# EAGLE board Spuds-V0.6 (EAGLE 6.4), part 1 of 2
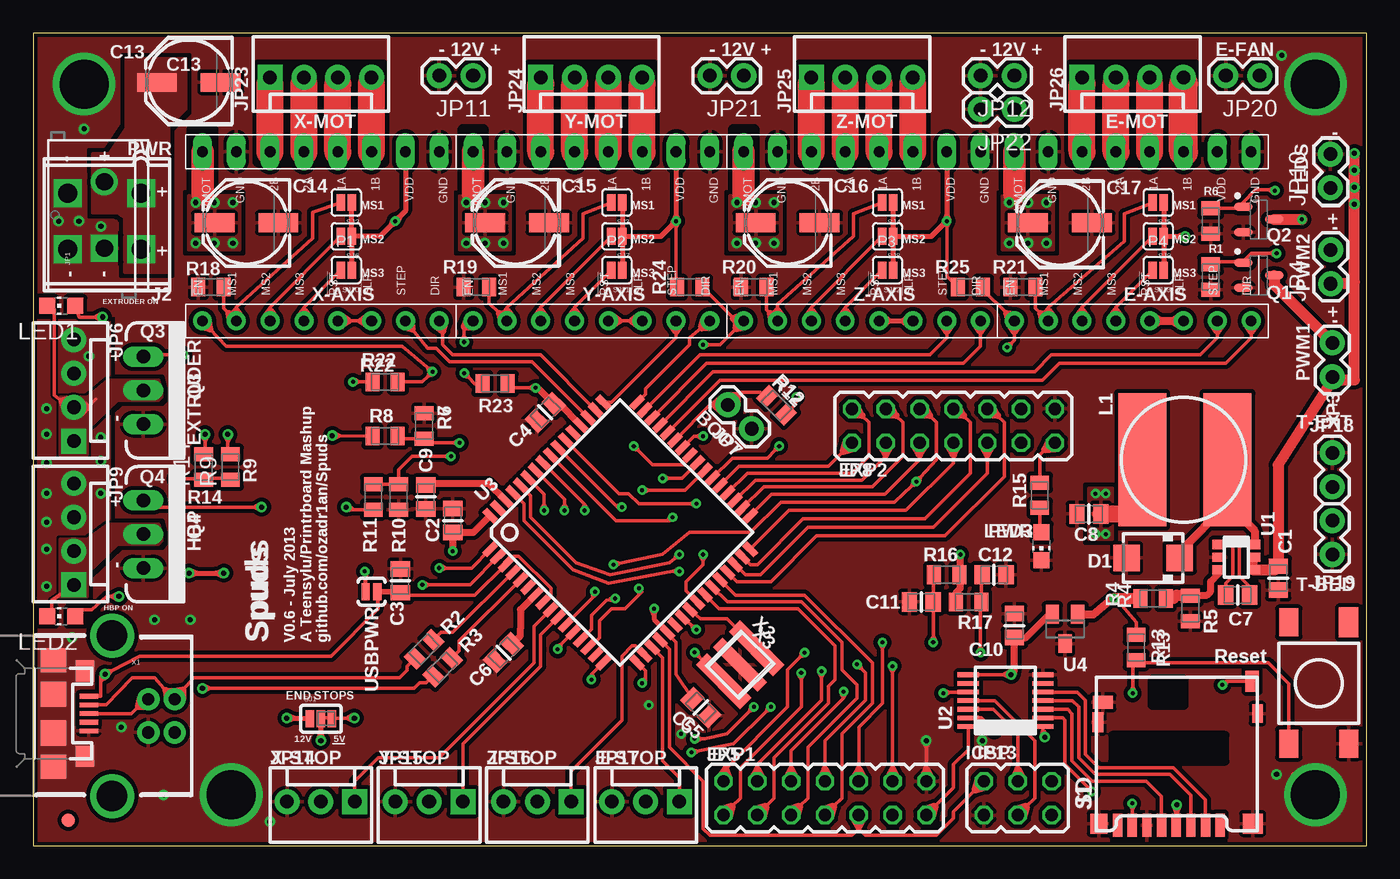
[diagram p1: board, top side]
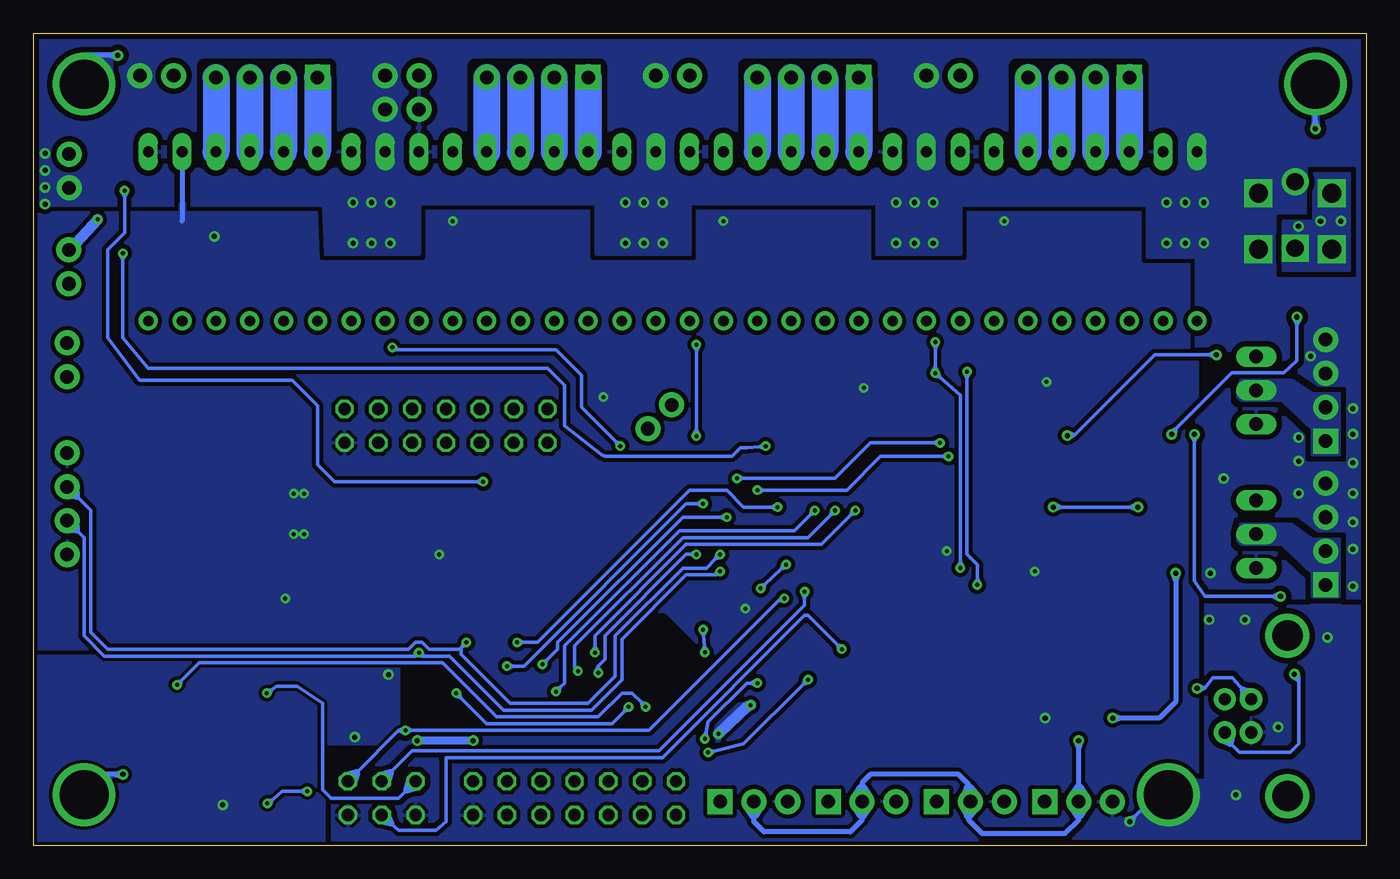
[diagram p2: board, bottom side, seen from below]

Size 100.08 x 60.96 mm. Coordinates in mm from the lower left corner, seen from the top.
Outline: 0,60.96 0,0 100.08,0 100.08,60.96 0,60.96
Copper layers (1*2*15*16): Top 0.035mm / dielectric 0.2mm / Route2 0.0175mm / dielectric 1.1mm / Route15 0.0175mm / dielectric 0.2mm / Bottom 0.035mm
Design rules "SeeedStudio_DRU_no_angle_20130527 *": minimum track width 6mil, minimum drill 12mil, track to track 6mil, track to pad 6mil, pad to pad 6mil, via to via 6mil, smd to smd 0mil, copper to edge 10mil, drill to drill 10mil, minimum pad ring 8mil, minimum via ring 8mil, stop-mask expansion 2mil, vias tented up to drill 25mil, thermal gap 10mil
tRestrict: area 11.9,49.4 to 13.5,53.7; area 32.3,49.4 to 33.8,53.7; area 52.6,49.4 to 54.1,53.7; area 72.9,49.4 to 74.4,53.7; area 57.5,51.3 to 66.9,58.5; area 77.9,51.3 to 87.2,58.5; area 16.9,51.3 to 26.3,58.5; area 37.2,51.3 to 46.6,58.5
bRestrict: area 37.2,51.3 to 46.6,58.5; area 16.9,51.3 to 26.3,58.5; area 57.5,51.3 to 66.9,58.5; area 77.9,51.3 to 87.2,58.5; area 49.7,10.5 to 56.1,17

## Footprints (pad centres in the part's own frame; a part is rotated, then mirrored left to right if it is on the bottom)
CAPC2012X145AN = smd 1.15 x 1.45: 1 -0.9,0; 2 0.9,0
PANASONIC_D = smd 3 x 1.4: + 2.4,0; - -2.4,0
SMA = smd 2 x 2: A 2,0; C -2,0
AMPHENOL-MICROSD = smd 0.7 x 1.75: 1 3.636,-5.842; 2 2.536,-5.842; 3 1.436,-5.842; 4 0.336,-5.842; 5 -0.764,-5.842; 6 -1.864,-5.842; 7 -2.964,-5.842; 8 -4.064,-5.842 | smd 1.29 x 1.5: C1 -5.464,-5.717 | smd 1.5 x 1.5: C2 6.086,-5.717 | smd 0.8 x 1.5: C3 -5.539,1.883 | smd 0.8 x 1.4: C4 6.436,2.533 | smd 1.5 x 1: CD1 -5.164,3.383 | smd 1 x 1.55: CD2 6.036,4.958
5566-4 = drill 1.4 square: 1 2.1,-2.75; 2 -2.1,-2.75; 3 2.1,2.75; 4 -2.1,2.75
SCREWTERMINAL-5MM-2 = drill 1.3 pad 2.032 square: 1 0,0 | drill 1.3 pad 2.032: 2 5,0
FIDUCIAL-1X2.5 = smd 1 x 1: 1 0,0
1X02 = drill 1.016 pad 1.88: 1 0,0; 2 2.54,0
JP7Q = drill 0.914 octagon: 1 -7.62,-1.27; 2 -7.62,1.27; 3 -5.08,-1.27; 4 -5.08,1.27; 5 -2.54,-1.27; 6 -2.54,1.27; 7 0,-1.27; 8 0,1.27; 9 2.54,-1.27; 10 2.54,1.27; 11 5.08,-1.27; 12 5.08,1.27; 13 7.62,-1.27; 14 7.62,1.27
MOLEX-1X4 = drill 1.016 pad 1.88 square: 1 0,0 | drill 1.016 pad 1.88: 2 2.54,0; 3 5.08,0; 4 7.62,0
JP3Q = drill 0.914 octagon: 1 -2.54,-1.27; 2 -2.54,1.27; 3 0,-1.27; 4 0,1.27; 5 2.54,-1.27; 6 2.54,1.27
MOLEX-1X3 = drill 1.016 pad 1.88 square: 1 0,0 | drill 1.016 pad 1.88: 2 2.54,0; 3 5.08,0
SDR1006 = smd 10.008 x 3.607: P$1 0,3.048; P$2 0,-3.353
CHIP-LED0805 = smd 1.2 x 1.2: A 0,-1.05; C 0,1.05
POLOLU-ALLEGRO-PTH = drill 0.8 pad 1.422 long: 1A 6.35,-1.27; 1B 6.35,-3.81; 2A 6.35,1.27; 2B 6.35,3.81; GNDMOT 6.35,6.35; GNDVDD 6.35,-8.89; VDD 6.35,-6.35; VMOT 6.35,8.89 | drill 0.8 pad 1.422: !EN -6.35,8.89; !RST -6.35,-1.27; !SLP -6.35,-3.81; DIR -6.35,-8.89; MS1 -6.35,6.35; MS2 -6.35,3.81; MS3 -6.35,1.27; STEP -6.35,-6.35
SOT95P280X135-3N = smd 1.4 x 0.65: 1 -1.15,0.95; 2 -1.15,-0.95; 3 1.15,0
TO220V = drill 1.016 long: 1 -2.54,0; 2 0,0; 3 2.54,0
RESC2012X70N = smd 1.05 x 1.4: 1 -0.95,0; 2 0.95,0
TACTILE_SWITCH_TALL = smd 2.1 x 1.45: A1 -4.55,-2.25; A2 4.55,-2.25; B2 4.55,2.25 | smd 2.25 x 1.45: B1 -4.55,2.225
SJ_3_PASTE2&3 = smd 0.635 x 1.27: 1 -0.813,0; 2 0,0; 3 0.813,0
SJ_2S = smd 0.635 x 1.27: 1 -0.412,0; 2 0.412,0
TSOT6 = smd 0.69 x 1: 1 -1,-1.4; 2 -0.05,-1.4; 3 0.9,-1.4; 4 0.9,1.2; 5 -0.05,1.2; 6 -1,1.2
TSSOP14 = smd 0.35 x 1.6: 1 -2,-2.9; 2 -1.35,-2.9; 3 -0.7,-2.9; 4 -0.05,-2.9; 5 0.6,-2.9; 6 1.25,-2.9; 7 1.9,-2.9; 8 1.9,2.7; 9 1.25,2.7; 10 0.6,2.7; 11 -0.05,2.7; 12 -0.7,2.7; 13 -1.35,2.7; 14 -2,2.7
TQFP64-2 = smd 1.194 x 0.508: 1 -7.8,6; 2 -7.8,5.2; 3 -7.8,4.4; 4 -7.8,3.6; 5 -7.8,2.8; 6 -7.8,2; 7 -7.8,1.2; 8 -7.8,0.4; 9 -7.8,-0.4; 10 -7.8,-1.2; 11 -7.8,-2; 12 -7.8,-2.8; 13 -7.8,-3.6; 14 -7.8,-4.4; 15 -7.8,-5.2; 16 -7.8,-6; 33 7.8,-6; 34 7.8,-5.2; 35 7.8,-4.4; 36 7.8,-3.6; 37 7.8,-2.8; 38 7.8,-2; 39 7.8,-1.2; 40 7.8,-0.4; 41 7.8,0.4; 42 7.8,1.2; 43 7.8,2; 44 7.8,2.8; 45 7.8,3.6; 46 7.8,4.4; 47 7.8,5.2; 48 7.8,6 | smd 0.508 x 1.194: 17 -6,-7.8; 18 -5.2,-7.8; 19 -4.4,-7.8; 20 -3.6,-7.8; 21 -2.8,-7.8; 22 -2,-7.8; 23 -1.2,-7.8; 24 -0.4,-7.8; 25 0.4,-7.8; 26 1.2,-7.8; 27 2,-7.8; 28 2.8,-7.8; 29 3.6,-7.8; 30 4.4,-7.8; 31 5.2,-7.8; 32 6,-7.8; 49 6,7.8; 50 5.2,7.8; 51 4.4,7.8; 52 3.6,7.8; 53 2.8,7.8; 54 2,7.8; 55 1.2,7.8; 56 0.4,7.8; 57 -0.4,7.8; 58 -1.2,7.8; 59 -2,7.8; 60 -2.8,7.8; 61 -3.6,7.8; 62 -4.4,7.8; 63 -5.2,7.8; 64 -6,7.8
SOT23C = smd 1 x 1.4: 1 -0.95,-1.1; 2 0.95,-1.1; 3 0,1.1
SJ_2S-NO = smd 0.635 x 1.27: 1 -0.45,0; 2 0.45,0
USB-B-PTH = drill 0.914 pad 1.676: D+ 0,1.25; D- 1.981,1.25; GND 0,-1.25; VBUS 1.981,-1.25 | drill 2.286: S1 -2.718,-6.02; S2 -2.718,6.02
USB-MICROB = smd 0.35 x 1.4: D+ 0,2.65; D- -0.65,2.65; GND 1.3,2.65; ID 0.65,2.65; VBUS -1.3,2.65 | smd 1.8 x 1.9: MT1 -4,0; MT2 4,0 | smd 1.9 x 1.9: MT3 -1.45,0; MT4 1.45,0 | smd 1.6 x 1.4: MT5 -3.2,2.35; MT6 3.2,2.35
AWSCR = smd 1 x 4.7: GND 0,0 | smd 1.2 x 4.7: IN -1.75,0; OUT 1.75,0

## Placement (x,y rotation side)
C1  1uF  [CAPC2012X145AN]  93.47,20.07 270 top
C2  0.1uF  [CAPC2012X145AN]  31.5,24.38 270 top
C3  0.1uF  [CAPC2012X145AN]  27.56,19.87 90 top
C4  0.1uF  [CAPC2012X145AN]  38.43,32.51 45 top
C5  0.1uF  [CAPC2012X145AN]  50.11,10.36 135 top
C6  1uF  [CAPC2012X145AN]  35.31,14.48 45 top
C7  0.22uF  [CAPC2012X145AN]  90.42,18.8 180 top
C8  22uF  [CAPC2012X145AN]  79.25,24.89 180 top
C9  0.1uF  [CAPC2012X145AN]  29.46,26.16 270 top
C10  10uF  [CAPC2012X145AN]  73.66,16.51 90 top
C11  10uF  [CAPC2012X145AN]  66.67,18.29 0 top
C12  10uF  [CAPC2012X145AN]  72.14,20.32 180 top
C13  100uF  [PANASONIC_D]  11.68,57.28 180 top
C14  100uF  [PANASONIC_D]  16,46.74 180 top
C15  100uF  [PANASONIC_D]  36.32,46.74 180 top
C16  100uF  [PANASONIC_D]  56.64,46.74 180 top
C17  100uF  [PANASONIC_D]  77.09,46.74 180 top
D1  [SMA]  84.07,21.59 180 top
DRILEGEND  [DRILEGEND]  121.13,58.19 0 top  (outside the outline)
J1  MICROSD  [AMPHENOL-MICROSD]  85.47,7.37 0 top
J2  ATX  [5566-4]  5.33,46.85 90 top
JP1  M025MM  [SCREWTERMINAL-5MM-2]  5.33,44.82 90 top
JP2  FIDUCIAL1X2.5  [FIDUCIAL-1X2.5]  2.6,1.91 0 top
JP3  PWM1  [1X02]  97.54,35.18 90 top
JP4  PWM2  [1X02]  97.41,42.16 90 top
JP5  EXP  [JP7Q]  59.44,3.56 0 top
JP6  HOTEND  [MOLEX-1X4]  3.05,30.35 90 top
JP7  BOOT  [1X02]  53.94,31.28 135 top
JP8  EXP  [JP7Q]  69.09,31.5 180 top
JP9  HOTBED  [MOLEX-1X4]  3.05,19.56 90 top
JP10  LEDS  [1X02]  97.38,49.35 90 top
JP11  12V-1  [1X02]  33.02,57.78 180 top
JP12  12V-3A  [1X02]  73.66,57.78 180 top
JP13  ICSP  [JP3Q]  73.91,3.56 0 top
JP14  X-STOP  [MOLEX-1X3]  24.13,3.3 180 top
JP15  Y-STOP  [MOLEX-1X3]  32.26,3.3 180 top
JP16  Z-STOP  [MOLEX-1X3]  40.39,3.3 180 top
JP17  E-STOP  [MOLEX-1X3]  48.51,3.3 180 top
JP18  E-THERM  [1X02]  97.54,26.92 90 top
JP19  B-THERM  [1X02]  97.54,24.38 270 top
JP20  E-FAN  [1X02]  92.08,57.78 180 top
JP21  12V-2  [1X02]  53.34,57.78 180 top
JP22  12V-3B  [1X02]  73.66,55.24 180 top
JP23  MOT-X  [MOLEX-1X4]  17.78,57.66 0 top
JP24  MOT-Y  [MOLEX-1X4]  38.1,57.66 0 top
JP25  MOT-Z  [MOLEX-1X4]  58.42,57.66 0 top
JP26  MOT-E  [MOLEX-1X4]  78.74,57.66 0 top
L1  47uH  [SDR1006]  86.61,28.96 270 top
LED1  EXT  [CHIP-LED0805]  2.1,40.5 90 top
LED2  HBP  [CHIP-LED0805]  2.1,17.2 90 top
LED3  PWR  [CHIP-LED0805]  75.69,22.48 180 top
P1  POLOLU-X  [POLOLU-ALLEGRO-PTH]  21.59,45.72 90 top
P2  POLOLU-Y  [POLOLU-ALLEGRO-PTH]  41.91,45.72 90 top
P3  POLOLU-Z  [POLOLU-ALLEGRO-PTH]  62.23,45.72 90 top
P4  POLOLU-E  [POLOLU-ALLEGRO-PTH]  82.55,45.72 90 top
Q1  RFP30N06LE  [SOT95P280X135-3N]  92.01,42.8 0 top
Q2  RFP30N06LE  [SOT95P280X135-3N]  92.01,46.99 0 top
Q3  RFP30N06LE  [TO220V]  8.26,34.16 270 top
Q4  RFP30N06LE  [TO220V]  8.26,23.37 270 top
R1  100k  [RESC2012X70N]  88.39,42.67 270 top
R2  22  [RESC2012X70N]  29.34,14.73 45 top
R3  22  [RESC2012X70N]  30.72,13.37 45 top
R4  5.6k  [RESC2012X70N]  84.07,18.54 0 top
R5  1k  [RESC2012X70N]  86.87,17.78 270 top
R6  100k  [RESC2012X70N]  88.39,46.86 270 top
R7  100k  [RESC2012X70N]  29.34,31.5 90 top
R8  100  [RESC2012X70N]  26.42,30.73 180 top
R9  1.8K  [RESC2012X70N]  14.8,28.4 90 top
R10  100k  [RESC2012X70N]  27.43,26.16 270 top
R11  100  [RESC2012X70N]  25.53,26.16 270 top
R12  100k  [RESC2012X70N]  55.8,33.04 315 top
R13  100k  [RESC2012X70N]  82.8,14.86 90 top
R14  1.8K  [RESC2012X70N]  12.79,28.4 90 top
R15  330  [RESC2012X70N]  75.56,26.29 90 top
R16  4.7k  [RESC2012X70N]  68.58,20.32 0 top
R17  4.7k  [RESC2012X70N]  70.23,18.29 180 top
R18  100k  [RESC2012X70N]  13.34,41.91 0 top
R19  100k  [RESC2012X70N]  33.27,41.91 0 top
R20  100k  [RESC2012X70N]  54.1,41.91 180 top
R21  100k  [RESC2012X70N]  74.3,41.91 0 top
R22  100k  [RESC2012X70N]  26.42,34.8 0 top
R23  100k  [RESC2012X70N]  34.67,34.67 180 top
R24  100k  [RESC2012X70N]  49.28,41.91 0 top
R25  100k  [RESC2012X70N]  70.36,41.91 0 top
S1  Reset  [TACTILE_SWITCH_TALL]  96.52,12.19 270 top
SJ1  END-STOPS-PWR  [SJ_3_PASTE2&3]  21.59,9.53 0 top
SJ2  X-MS1  [SJ_2S]  23.5,48.26 180 top
SJ3  Y-MS1  [SJ_2S]  43.81,48.26 180 top
SJ4  Z-MS1  [SJ_2S]  64.14,48.26 180 top
SJ5  E-MS1  [SJ_2S]  84.45,48.26 180 top
SJ6  X-MS2  [SJ_2S]  23.5,45.72 180 top
SJ7  Y-MS2  [SJ_2S]  43.81,45.72 180 top
SJ8  Z-MS2  [SJ_2S]  64.14,45.72 180 top
SJ9  E-MS2  [SJ_2S]  84.45,45.72 180 top
SJ10  X-MS3  [SJ_2S]  23.5,43.18 180 top
SJ11  Y-MS3  [SJ_2S]  43.81,43.18 180 top
SJ12  Z-MS3  [SJ_2S]  64.14,43.18 180 top
SJ13  E-MS3  [SJ_2S]  84.45,43.18 180 top
U1  LM2841  [TSOT6]  90.42,21.59 270 top
U2  TXB0104  [TSSOP14]  72.9,10.92 90 top
U3  AT90USB1286  [TQFP64-2]  44.07,23.5 45 top
U4  AP7313  [SOT23C]  77.47,16.26 180 top
USBPWR  [SJ_2S-NO]  25.4,19.05 180 top
X1  USBPTH  [USB-B-PTH]  8.64,9.73 0 top
X2  USB-MICROB  [USB-MICROB]  1.52,9.91 270 top
X3  16MHz  [AWSCR]  53.06,13.57 225 top